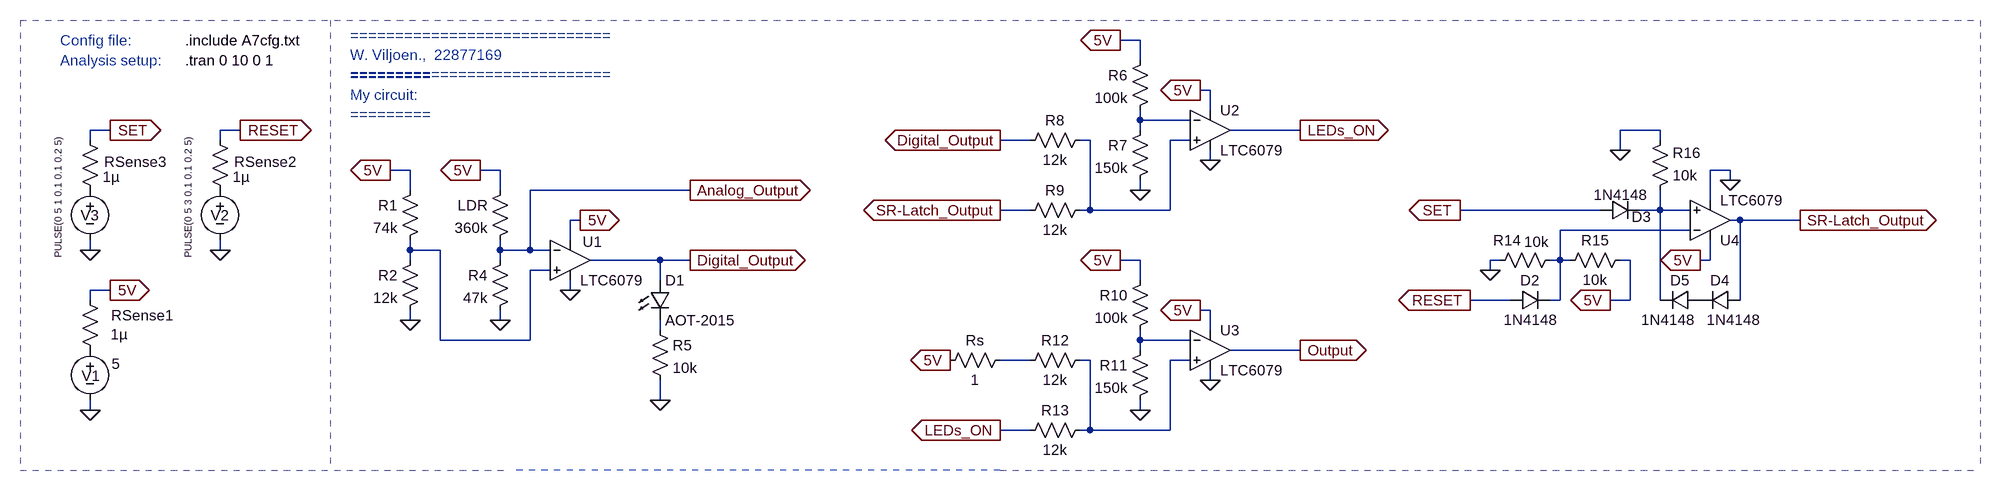
[diagram p0: schematic E344_22877169_A7.asc]
E344_22877169_A7.asc, the LTspice schematic file:
Version 4
SHEET 1 3268 1400
WIRE 1264 32 1232 32
WIRE 1264 64 1264 32
WIRE 1376 112 1360 112
WIRE 1376 144 1376 112
WIRE 1264 160 1264 144
WIRE 1344 160 1264 160
WIRE -384 176 -416 176
WIRE -176 176 -208 176
WIRE 1264 176 1264 160
WIRE 1520 176 1408 176
WIRE 2096 176 2032 176
WIRE -416 192 -416 176
WIRE -208 192 -208 176
WIRE 1088 192 1040 192
WIRE 1184 192 1168 192
WIRE 1344 192 1312 192
WIRE 2096 192 2096 176
WIRE 2032 208 2032 176
WIRE 1376 224 1376 208
WIRE 96 240 64 240
WIRE 240 240 208 240
WIRE 2208 240 2176 240
WIRE 2208 256 2208 240
WIRE 96 272 96 240
WIRE 240 272 240 240
WIRE 544 272 288 272
WIRE 1264 272 1264 256
WIRE 2176 288 2176 240
WIRE 1088 304 1040 304
WIRE 1184 304 1184 192
WIRE 1184 304 1168 304
WIRE 1312 304 1312 192
WIRE 1312 304 1184 304
WIRE 2000 304 1776 304
WIRE 2096 304 2096 272
WIRE 2096 304 2064 304
WIRE 2144 304 2096 304
WIRE 368 320 352 320
WIRE 2224 320 2208 320
WIRE 2320 320 2224 320
WIRE 2144 336 1936 336
WIRE 352 352 352 320
WIRE -416 368 -416 352
WIRE -208 368 -208 352
WIRE 96 368 96 352
WIRE 144 368 96 368
WIRE 240 368 240 352
WIRE 288 368 288 272
WIRE 288 368 240 368
WIRE 320 368 288 368
WIRE 96 384 96 368
WIRE 240 384 240 368
WIRE 496 384 384 384
WIRE 544 384 496 384
WIRE 1264 384 1232 384
WIRE 1840 384 1824 384
WIRE 1936 384 1936 336
WIRE 1936 384 1920 384
WIRE 1952 384 1936 384
WIRE 2048 384 2032 384
WIRE 2176 384 2176 352
WIRE 2176 384 2160 384
WIRE 320 400 288 400
WIRE 1824 400 1824 384
WIRE 496 416 496 384
WIRE 1264 416 1264 384
WIRE -384 432 -416 432
WIRE 352 432 352 416
WIRE -416 448 -416 432
WIRE 1856 448 1792 448
WIRE 1936 448 1936 384
WIRE 1936 448 1920 448
WIRE 2048 448 2048 384
WIRE 2048 448 2016 448
WIRE 2096 448 2096 304
WIRE 2224 448 2224 320
WIRE 1376 464 1360 464
WIRE 96 480 96 464
WIRE 240 480 240 464
WIRE 496 496 496 480
WIRE 1376 496 1376 464
WIRE 144 512 144 368
WIRE 288 512 288 400
WIRE 288 512 144 512
WIRE 1264 512 1264 496
WIRE 1344 512 1264 512
WIRE 1264 528 1264 512
WIRE 1520 528 1408 528
WIRE 1088 544 1040 544
WIRE 1184 544 1168 544
WIRE 1344 544 1312 544
WIRE 1376 576 1376 560
WIRE 496 608 496 576
WIRE -416 624 -416 608
WIRE 1264 624 1264 608
WIRE 1088 656 1040 656
WIRE 1184 656 1184 544
WIRE 1184 656 1168 656
WIRE 1312 656 1312 544
WIRE 1312 656 1184 656
FLAG 1824 400 0
FLAG 2208 256 0
FLAG 2160 384 5V
IOPIN 2160 384 Out
FLAG 2032 208 0
FLAG 2016 448 5V
IOPIN 2016 448 Out
FLAG 1376 224 0
FLAG 1360 112 5V
IOPIN 1360 112 Out
FLAG 1264 272 0
FLAG 1232 32 5V
IOPIN 1232 32 Out
FLAG 1376 576 0
FLAG 1360 464 5V
IOPIN 1360 464 Out
FLAG 1264 624 0
FLAG 1232 384 5V
IOPIN 1232 384 Out
FLAG 352 432 0
FLAG 368 320 5V
IOPIN 368 320 Out
FLAG 240 480 0
FLAG 208 240 5V
IOPIN 208 240 Out
FLAG 96 480 0
FLAG 64 240 5V
IOPIN 64 240 Out
FLAG 496 608 0
FLAG 1776 304 SET
IOPIN 1776 304 Out
FLAG 1792 448 RESET
IOPIN 1792 448 Out
FLAG 544 384 Digital_Output
IOPIN 544 384 Out
FLAG 544 272 Analog_Output
IOPIN 544 272 Out
FLAG 1040 192 Digital_Output
IOPIN 1040 192 Out
FLAG 2320 320 SR-Latch_Output
IOPIN 2320 320 Out
FLAG 1520 176 LEDs_ON
IOPIN 1520 176 Out
FLAG 1040 656 LEDs_ON
IOPIN 1040 656 Out
FLAG 960 544 5V
IOPIN 960 544 Out
FLAG 1040 304 SR-Latch_Output
IOPIN 1040 304 Out
FLAG -416 624 0
FLAG -384 432 5V
IOPIN -384 432 Out
FLAG -176 176 RESET
IOPIN -176 176 Out
FLAG -208 368 0
FLAG -384 176 SET
IOPIN -384 176 Out
FLAG -416 368 0
FLAG 1520 528 Output
IOPIN 1520 528 Out
SYMBOL LTC6079 2176 320 M180
SYMATTR InstName U4
SYMBOL res 2048 368 R90
WINDOW 0 0 56 VBottom 2
WINDOW 3 32 56 VTop 2
SYMATTR InstName R15
SYMATTR Value 10k
SYMBOL res 1936 368 R90
WINDOW 0 0 85 VBottom 2
WINDOW 3 -29 38 VTop 2
SYMATTR InstName R14
SYMATTR Value 10k
SYMBOL res 2080 288 M180
WINDOW 0 36 76 Left 2
WINDOW 3 36 40 Left 2
SYMATTR InstName R16
SYMATTR Value 10k
SYMBOL diode 2000 288 M90
WINDOW 0 42 66 VBottom 2
WINDOW 3 -24 32 VTop 2
SYMATTR InstName D3
SYMATTR Value 1N4148
SYMBOL diode 2160 464 M270
WINDOW 0 32 32 VTop 2
WINDOW 3 0 52 VBottom 2
SYMATTR InstName D5
SYMATTR Value 1N4148
SYMBOL diode 2224 464 M270
WINDOW 0 32 32 VTop 2
WINDOW 3 0 11 VBottom 2
SYMATTR InstName D4
SYMATTR Value 1N4148
SYMBOL diode 1856 432 M90
WINDOW 0 0 32 VBottom 2
WINDOW 3 32 32 VTop 2
SYMATTR InstName D2
SYMATTR Value 1N4148
SYMBOL res 1280 48 M0
SYMATTR InstName R6
SYMATTR Value 100k
SYMBOL res 1280 160 M0
SYMATTR InstName R7
SYMATTR Value 150k
SYMBOL res 1184 176 R90
WINDOW 0 0 56 VBottom 2
WINDOW 3 32 56 VTop 2
SYMATTR InstName R8
SYMATTR Value 12k
SYMBOL res 1184 288 R90
WINDOW 0 0 56 VBottom 2
WINDOW 3 32 56 VTop 2
SYMATTR InstName R9
SYMATTR Value 12k
SYMBOL LTC6079 1376 176 R0
SYMATTR InstName U2
SYMBOL res 1280 400 M0
SYMATTR InstName R10
SYMATTR Value 100k
SYMBOL res 1280 512 M0
SYMATTR InstName R11
SYMATTR Value 150k
SYMBOL res 1184 528 R90
WINDOW 0 0 56 VBottom 2
WINDOW 3 32 56 VTop 2
SYMATTR InstName R12
SYMATTR Value 12k
SYMBOL res 1184 640 R90
WINDOW 0 0 56 VBottom 2
WINDOW 3 32 56 VTop 2
SYMATTR InstName R13
SYMATTR Value 12k
SYMBOL LTC6079 1376 528 R0
SYMATTR InstName U3
SYMBOL res 256 256 M0
SYMATTR InstName LDR
SYMATTR Value 360k
SYMBOL res 256 368 M0
SYMATTR InstName R4
SYMATTR Value 47k
SYMBOL LTC6079 352 384 R0
WINDOW 0 20 -29 Left 2
SYMATTR InstName U1
SYMBOL res 112 256 M0
SYMATTR InstName R1
SYMATTR Value 74k
SYMBOL res 112 368 M0
SYMATTR InstName R2
SYMATTR Value 12k
SYMBOL res 480 480 R0
SYMATTR InstName R5
SYMATTR Value 10k
SYMBOL LED 480 416 R0
SYMATTR InstName D1
SYMATTR Value AOT-2015
SYMBOL res 1056 528 R90
WINDOW 0 0 56 VBottom 2
WINDOW 3 32 56 VTop 2
SYMATTR InstName Rs
SYMATTR Value 1
SYMBOL voltage -416 512 R0
WINDOW 123 0 0 Left 0
WINDOW 39 0 0 Left 0
WINDOW 0 -13 57 Left 2
WINDOW 3 35 38 Left 2
SYMATTR InstName V1
SYMATTR Value 5
SYMBOL res -432 432 R0
WINDOW 0 50 40 Left 2
WINDOW 3 49 71 Left 2
SYMATTR InstName RSense1
SYMATTR Value 1µ
SYMBOL voltage -208 256 R0
WINDOW 0 -15 56 Left 2
WINDOW 3 -51 125 VLeft 1
SYMATTR InstName V2
SYMATTR Value PULSE(0 5 3 0.1 0.1 0.2 5)
SYMBOL res -224 176 R0
WINDOW 0 39 51 Left 2
WINDOW 3 36 75 Left 2
SYMATTR InstName RSense2
SYMATTR Value 1µ
SYMBOL voltage -416 256 R0
WINDOW 0 -15 56 Left 2
WINDOW 3 -51 125 VLeft 1
SYMATTR InstName V3
SYMATTR Value PULSE(0 5 1 0.1 0.1 0.2 5)
SYMBOL res -432 176 R0
WINDOW 0 39 51 Left 2
WINDOW 3 36 75 Left 2
SYMATTR InstName RSense3
SYMATTR Value 1µ
TEXT -264 32 Left 2 !.include A7cfg.txt
TEXT -464 32 Left 2 ;Config file:
TEXT -464 64 Left 2 ;Analysis setup:
TEXT 0 24 Left 2 ;=============================\nW. Viljoen.,  22877169\n=============================
TEXT 0 88 Left 2 ;=========\nMy circuit:\n=========
TEXT -264 64 Left 2 !.tran 0 10 0 1
LINE Normal -32 0 -32 720 2
LINE Normal 256 0 1040 0 2
LINE Normal -528 0 -528 720 2
LINE Normal 1040 720 256 720 2
LINE Normal 1040 0 1824 0 2
LINE Normal 1040 720 1824 720 2
LINE Normal 1824 0 2608 0 2
LINE Normal 1824 720 2608 720 2
LINE Normal -528 0 256 0 2
LINE Normal -528 720 256 720 2
LINE Normal 2608 0 2608 720 2

The netlist it stands for:
* E344_22877169_A7.asc
XU4 N003 N004 5V 0 SR-Latch_Output LTC6078  ; LTC6079, pins In+ In- V+ V- OUT
R15 5V N004 10k
R14 N004 0 10k
R16 N003 0 10k
D3 SET N003 1N4148
D5 P001 N003 1N4148
D4 SR-Latch_Output P001 1N4148
D2 RESET N004 1N4148
R6 5V N001 100k
R7 N001 0 150k
R8 N002 Digital_Output 12k
R9 N002 SR-Latch_Output 12k
XU2 N002 N001 5V 0 LEDs_ON LTC6078  ; LTC6079, pins In+ In- V+ V- OUT
R10 5V N007 100k
R11 N007 0 150k
R12 N009 N008 12k
R13 N009 LEDs_ON 12k
XU3 N009 N007 5V 0 Output LTC6078  ; LTC6079, pins In+ In- V+ V- OUT
R§LDR 5V Analog_Output 360k
R4 Analog_Output 0 47k
XU1 N005 Analog_Output 5V 0 Digital_Output LTC6078  ; LTC6079, pins In+ In- V+ V- OUT
R1 5V N005 74k
R2 N005 0 12k
R5 N006 0 10k
D1 Digital_Output N006 AOT-2015
Rs N008 5V 1
V1 P002 0 5
RSense1 5V P002 1µ
V2 P003 0 PULSE(0 5 3 0.1 0.1 0.2 5)
RSense2 RESET P003 1µ
V3 P004 0 PULSE(0 5 1 0.1 0.1 0.2 5)
RSense3 SET P004 1µ
.model D D
.lib standard.dio
.include A7cfg.txt
* Config file:
* Analysis setup:
* =============================
* W. Viljoen.,  22877169
* =============================
* =========
* My circuit:
* =========
.tran 0 10 0 1
.lib LTC5.lib
.backanno
.end